# EAGLE design shield (EAGLE 9.2.2)
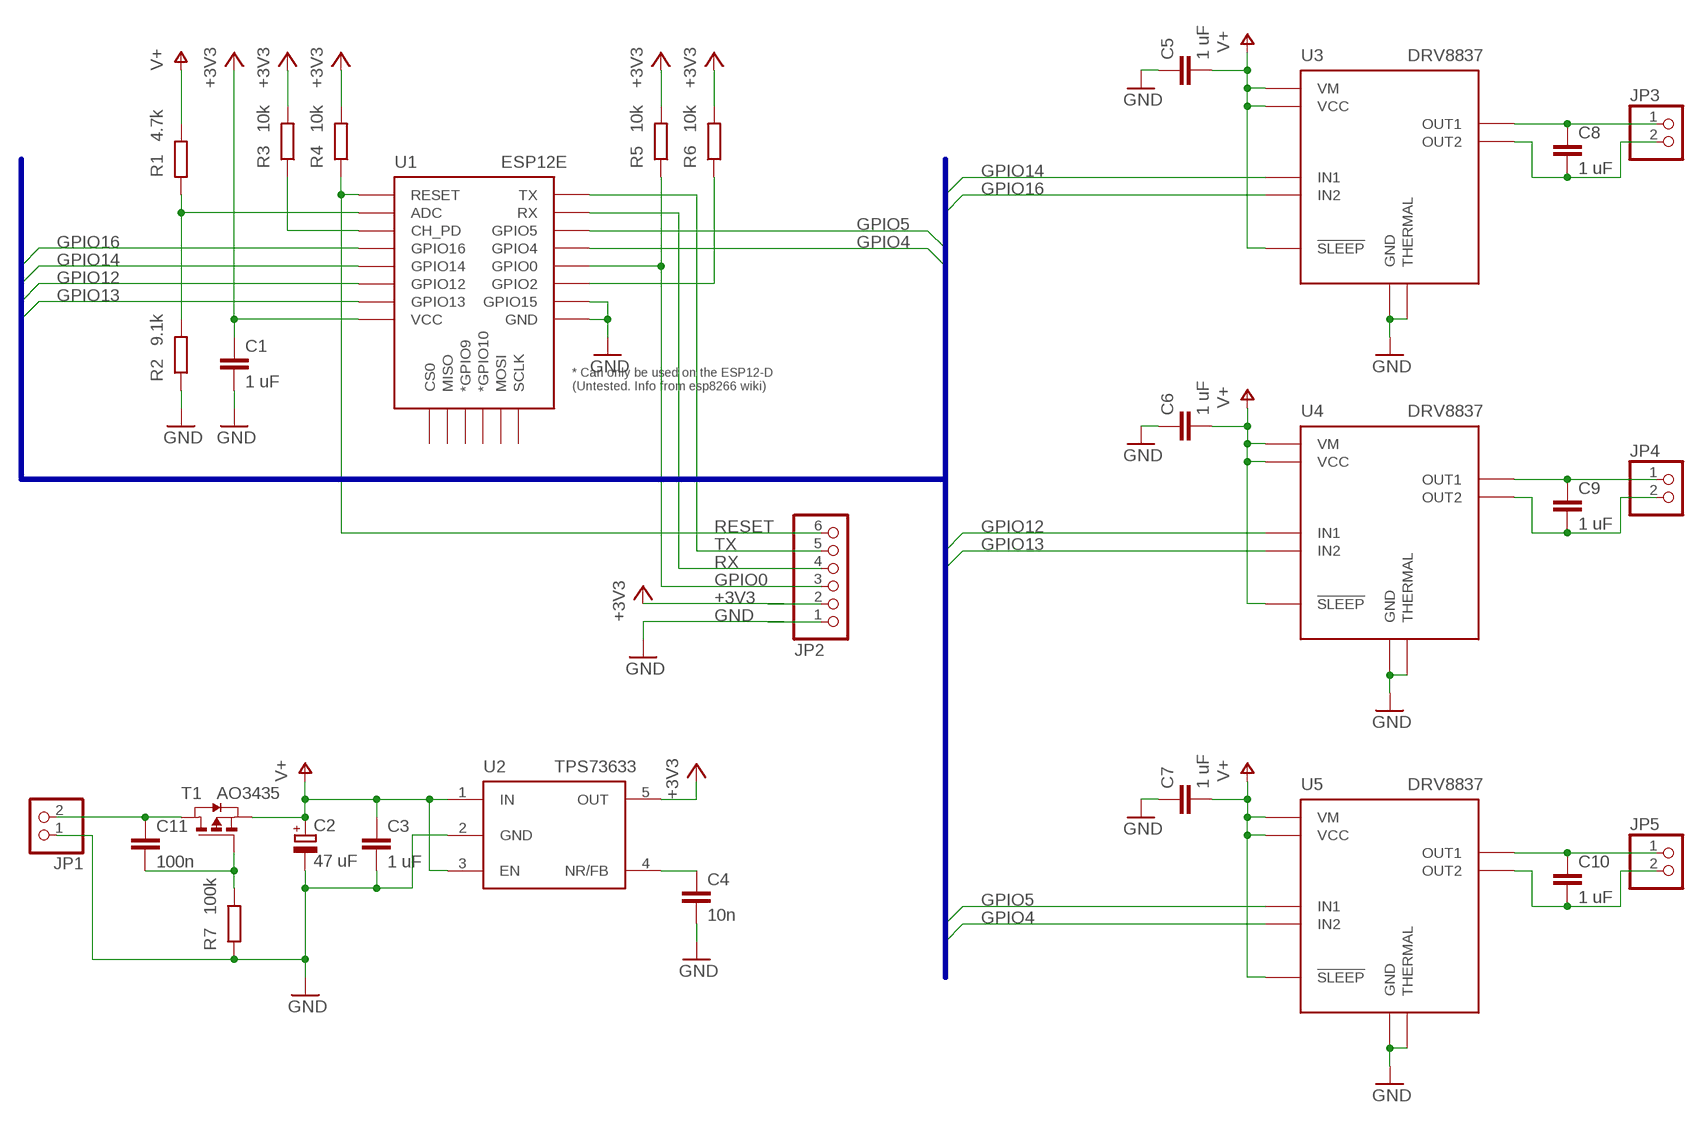
[diagram p0: schematic, sheet 1]

## Parts
C1  1 uF  C-EUC0805  [C0805]
C2  47 uF  CPOL-EUSMCA  [SMC_A]
C3  1 uF  C-EUC0805  [C0805]
C4  10n  C-EUC0603  [C0603]
C5  1 uF  C-EUC0805  [C0805]
C6  1 uF  C-EUC0805  [C0805]
C7  1 uF  C-EUC0805  [C0805]
C8  1 uF  C-EUC0805  [C0805]
C9  1 uF  C-EUC0805  [C0805]
C10  1 uF  C-EUC0805  [C0805]
C11  100n  C-EUC0603  [C0603]
JP1  PINHD-1X2  [1X02]
JP2  PINHD-1X6  [1X06]
JP3  PINHD-1X2  [1X02]
JP4  PINHD-1X2  [1X02]
JP5  PINHD-1X2  [1X02]
R1  4.7k  R-EU_R0603  [R0603]
R2  9.1k  R-EU_R0603  [R0603]
R3  10k  R-EU_R0603  [R0603]
R4  10k  R-EU_R0603  [R0603]
R5  10k  R-EU_R0603  [R0603]
R6  10k  R-EU_R0603  [R0603]
R7  100k  R-EU_R0603  [R0603]
T1  AO3435  PMOSSOT23  [SOT-23]
U1  ESP12E  ESP12ESMD  [ESP12E-SMD]
U2  TPS73633  [SOT23-5L]
U3  DRV8837  [QFN8]
U4  DRV8837  [QFN8]
U5  DRV8837  [QFN8]

## Nets
+3V3: C1.1 JP2.2 R3.2 R4.2 R5.2 R6.2 U1.VCC U2.5(OUT)
GND: C1.2 C2.- C3.2 C4.2 C5.1 C6.1 C7.1 JP1.1 JP2.1 R2.1 R7.1 U1.GND U1.GPIO15 U2.2(GND) U3.P$4(GND) U3.P$9(THERMAL) U4.P$4(GND) U4.P$9(THERMAL) U5.P$4(GND) U5.P$9(THERMAL)
GPIO0: JP2.3 R5.1 U1.GPIO0
GPIO4: U1.GPIO4 U5.P$5(IN2)
GPIO5: U1.GPIO5 U5.P$6(IN1)
GPIO12: U1.GPIO12 U4.P$6(IN1)
GPIO13: U1.GPIO13 U4.P$5(IN2)
GPIO14: U1.GPIO14 U3.P$6(IN1)
GPIO16: U1.GPIO16 U3.P$5(IN2)
N$1: R3.1 U1.CH_PD
N$2: R6.1 U1.GPIO2
N$3: C8.1 JP3.1 U3.P$2(OUT1)
N$4: C8.2 JP3.2 U3.P$3(OUT2)
N$5: C9.1 JP4.1 U4.P$2(OUT1)
N$6: C9.2 JP4.2 U4.P$3(OUT2)
N$7: C10.1 JP5.1 U5.P$2(OUT1)
N$8: C10.2 JP5.2 U5.P$3(OUT2)
N$9: R1.1 R2.2 U1.ADC
N$10: C4.1 U2.4(NR/FB)
N$14: C11.1 JP1.2 T1.1(D)
N$15: C11.2 R7.2 T1.3(G)
RESET: JP2.6 R4.1 U1.RESET
RX: JP2.4 U1.RXD0(RX)
TX: JP2.5 U1.TXD0(TX)
V+: C2.+ C3.1 C5.2 C6.2 C7.2 R1.2 T1.2(S) U2.1(IN) U2.3(EN) U3.P$1(VM) U3.P$7(!SLEEP) U3.P$8(VCC) U4.P$1(VM) U4.P$7(!SLEEP) U4.P$8(VCC) U5.P$1(VM) U5.P$7(!SLEEP) U5.P$8(VCC)
Unconnected: U1.CS0 U1.GPIO9(*GPIO9) U1.GPIO10(*GPIO10) U1.MISO U1.MOSI U1.SCLK

## Buses
GND,GPIO0,GPIO4,GPIO5,GPIO12,GPIO13,GPIO14,GPIO16,N$1,N$2,N$3,N$4,N$5,N$6,N$7,N$8,RESET,RX,TX,VCC

## Library data of the parts
C1 C3-C11 = rcl:C-EU: CAPACITOR, European symbol; SPICEPREFIX: C
C2 = rcl:CPOL-EU: POLARIZED CAPACITOR, European symbol; SPICEPREFIX: C
JP1 JP3-JP5 = pinhead:PINHD-1X2: PIN HEADER
JP2 = pinhead:PINHD-1X6: PIN HEADER
R1-R7 = rcl:R-EU_: RESISTOR, European symbol; SPICEPREFIX: R
T1 = zetex:PMOSSOT23: MOS FET; OC_FARNELL: unknown; OC_NEWARK: unknown
U1 = esp8266modules:ESP12E: ESP12E Module
U2 = Eagle-Library:TPS73633
U3-U5 = bt_motordriver:DRV8837: DRV8837 Low Voltage H-Bridge The DRV8837 provides an integrated motor-driver solution for cameras, consumer products, toys, and other low-voltage or battery-powered motion-control applications. The device has one H-bridge driver, and can drive one dc motor or one winding of a stepper motor, as well as other devices like solenoids. Reference: http://www.ti.com/lit/ds/symlink/drv8837.pdf

## Board
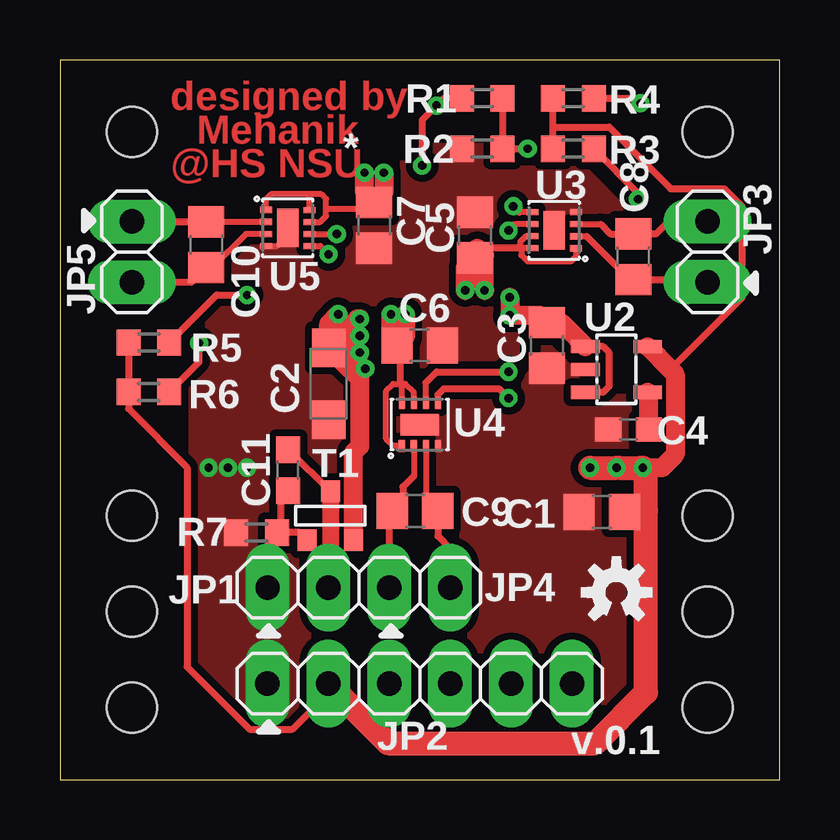
[diagram p1: board, top side]
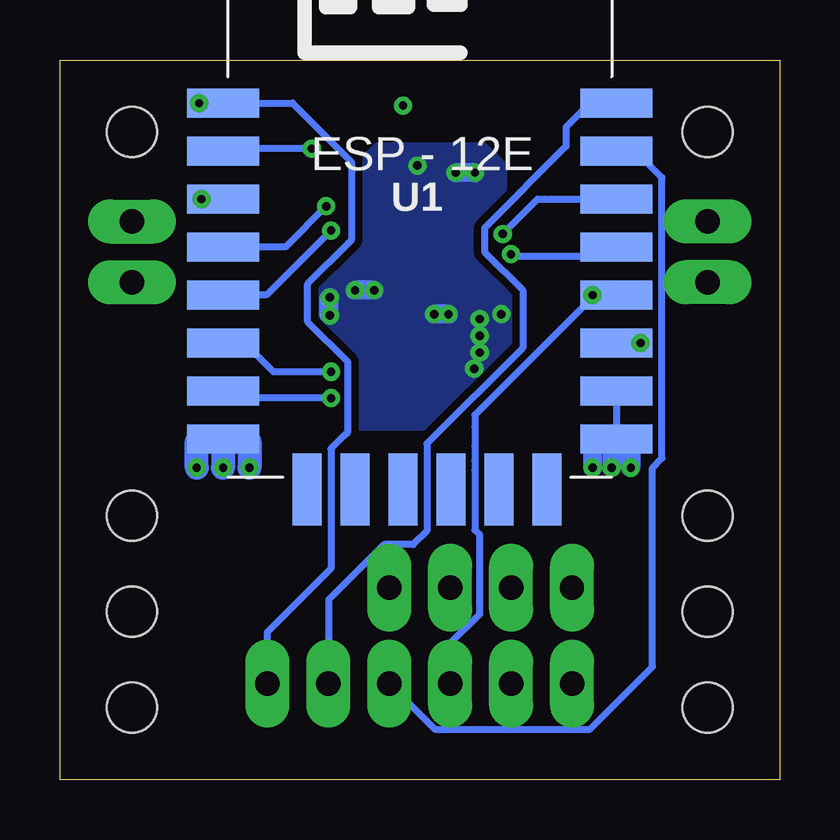
[diagram p2: board, bottom side, seen from below]

Size 30 x 30 mm. Coordinates in mm from the lower left corner, seen from the top.
Outline: 0,0 30,0 30,30 0,30 0,0
Copper layers (1*16): Top 0.035mm / dielectric 0.6mm / Bottom 0.035mm
Design rules "default *": minimum track width 6mil, minimum drill 0.35mm, track to track 6mil, track to pad 6mil, pad to pad 6mil, via to via 6mil, smd to smd 6mil, copper to edge 40mil, drill to drill 6mil, minimum pad ring 10mil, minimum via ring 8mil, stop-mask expansion 0.07mm, vias tented up to drill 1000mil, thermal gap 10mil
Holes 2.1 mm at 27,3 27,7 27,11 27,27 3,3 3,7 3,11 3,27

### Footprints (pad centres in the part's own frame; a part is rotated, then mirrored left to right if it is on the bottom)
C0805 = smd 1.3 x 1.5: 1 -0.95,0; 2 0.95,0
SMC_A = smd 1.6 x 1.4: + -1.5,0; - 1.5,0
C0603 = smd 1.1 x 1: 1 -0.85,0; 2 0.85,0
1X02 = drill 1.016 long: 1 -1.27,0; 2 1.27,0
1X06 = drill 1.016 long: 1 -6.35,0; 2 -3.81,0; 3 -1.27,0; 4 1.27,0; 5 3.81,0; 6 6.35,0
R0603 = smd 1 x 1.1: 1 -0.85,0; 2 0.85,0
SOT-23 = smd 0.787 x 0.889: 1 0.025,-1.016; 2 -0.94,1.016; 3 0.991,1.016
ESP12E-SMD = smd 3 x 1.2: ADC -8.3,3.8; CH_PD -8.3,1.8; GND 8.1,-8.2; GPIO0 8.1,-2.2; GPIO2 8.1,-4.2; GPIO4 8.1,-0.2; GPIO5 8.1,1.8; GPIO12 -8.3,-4.2; GPIO13 -8.3,-6.2; GPIO14 -8.3,-2.2; GPIO15 8.1,-6.2; GPIO16 -8.3,-0.2; RESET -8.3,5.8; RXD0 8.1,3.8; TXD0 8.1,5.8; VCC -8.3,-8.2 | smd 1.2 x 3: CS0 -4.8,-10.3; GPIO9 -0.8,-10.3; GPIO10 1.2,-10.3; MISO -2.8,-10.3; MOSI 3.2,-10.3; SCLK 5.2,-10.3
SOT23-5L = smd 0.55 x 1.2: 1 -0.95,-1.3; 2 0,-1.3; 3 0.95,-1.3; 4 0.95,1.3; 5 -0.95,1.3
QFN8 = smd 0.28 x 0.5: P$1 -0.75,-0.9; P$2 -0.25,-0.9 | smd 0.25 x 0.5: P$3 0.25,-0.9; P$4 0.75,-0.9; P$5 0.75,0.9; P$6 0.25,0.9; P$7 -0.25,0.9; P$8 -0.75,0.9 | smd 1.6 x 0.9: P$9 0,0

### Placement (x,y rotation side)
C1  22.59,11.16 180 top
C2  11.2,16.5 270 top
C3  20.3,18.1 270 top
C4  23.7,14.6 180 top
C5  17.3,22.7 270 top
C6  15,18.1 180 top
C7  13.1,23.1 90 top
C8  23.9,21.8 90 top
C9  14.8,11.2 0 top
C10  6.1,22.3 270 top
C11  9.5,12.9 270 top
JP1  9.93,8 0 top
JP2  15,4 0 top
JP3  27,22 90 top
JP4  15,8 0 top
JP5  3,22 270 top
R1  17.6,28.4 180 top
R2  17.6,26.3 0 top
R3  21.4,26.3 180 top
R4  21.4,28.4 180 top
R5  3.71,18.22 180 top
R6  3.71,16.16 180 top
R7  8.2,10.3 0 top
T1  11.3,11 180 top
U1  14.9,22.4 0 bottom
U2  23.2,17.1 270 top
U3  20.6,22.9 90 top
U4  15,14.8 0 top
U5  9.5,23 270 top

### Tracks (layer width: path | path; a pad name or v marks a point on that pad's centre or on a via)
+3V3  (via drill 0.35)
  Top 0.3: R5.2 R6.2 2.86,15.46 5.3,13.02 5.3,4.7 7.9,2.1 9.69,2.1 11.19,3.6 JP2.2 | R3.2 20.55,27 20.55,27.2 | 20.55,27.2 R4.2 | 20.55,27.2 22.9,27.2 25.47,24.63 27.7,24.63 28.43,23.9 28.43,20.08 25.45,17.1
  Top 0.8: v23.2,13 23.3,13 24.2,13 25.1,13 25.65,13.55 25.65,16.9 25.45,17.1 U2.5
  Top 1: v22.1,13 v23.2,13 | 23.3,13 24.2,13 | 24.2,13 v24.3,13 | JP2.2 13.67,1.52 22.32,1.52 24.43,3.63 24.43,11.2 | 24.2,13 24.43,12.77 24.43,11.2 | C1.1 24.39,11.16 24.43,11.2
  Bottom 1: v24.3,13 24.3,14.1 24.2,14.2 | v23.2,13 U1.VCC 22.2,14.2 22.1,14.1 v22.1,13
GND  (via drill 0.35)
  Top 0.254: U5.P$4 9.05,22.25 9.5,22.7 U5.P$9
  Top 1: C6.1 16.02,18.03
  Bottom 0.3: U1.GPIO15 U1.GND
  Bottom 0.8: 6.2,14.2 v6.2,13 | U1.GND 7.5,14.2 | U1.GND 7,14.4 | U1.GND 7,14 v7,13 | v7.8,13 7.8,14.2 U1.GND
  Bottom 1: 6.2,14.2 U1.GND
  pour Top (isolate 0.3, no thermals): 5.5,12.8 5.5,22.2 9.7,26.4 20.9,26.4 24.6,22.7 24.6,9.2 24.5,9.1 24.5,4.4 21.8,1.7 8.3,1.7 4.9,5.1 4.9,12.2
GPIO0  (via drill 0.35)
  Top 0.3: R5.1 6.54,20.2 v7.8,20.2
  Bottom 0.254: 12.7,14.7 12.7,12.9
  Bottom 0.3: U1.GPIO0 6.7,20.1 | v7.8,20.2 U1.GPIO0 | JP2.3 13.73,5.67 12.5,6.9 12.5,10.2 12.7,10.4 12.7,12.9 12.7,13.3 | 12.7,13.9 12.7,13.3 | U1.GPIO0 7.7,20.2 12.7,15.2 12.7,14.7 12.7,13.3
GPIO4  (via drill 0.35)
  Top 0.254: U5.P$5 10.85,22.25 v11.2,21.9
  Bottom 0.3: 7.1,21.9 U1.GPIO4 7.2,21.8 11.1,21.8 v11.2,21.9
GPIO5  (via drill 0.35)
  Top 0.254: U5.P$6 v11.54,22.75
  Top 0.3: v11.54,22.75 v11.54,22.74
  Bottom 0.3: U1.GPIO5 9.5,24.2 10.09,24.2 v11.54,22.74
GPIO12  (via drill 0.35)
  Top 0.254: U4.P$6 15.25,16.55
  Top 0.3: 15.25,16.55 15.7,17 v18.7,17
  Bottom 0.3: 21.4,17.3 21.95,17.85 | 21.95,17.85 22.3,18.2 U1.GPIO12 | 21.95,17.85 21.1,17 v18.7,17
GPIO13  (via drill 0.35)
  Top 0.254: U4.P$5 15.75,16.05
  Top 0.3: 15.75,16.05 16,16.3 18.3,16.3 v18.7,15.9
  Bottom 0.3: 22.9,16.5 23.15,16.25 | 23.15,16.25 U1.GPIO13 22.9,15.9 v18.7,15.9 | 23.1,16.3 23.15,16.25
GPIO14  (via drill 0.35)
  Top 0.254: U3.P$6 19.01,23.15 18.98,23.12
  Top 0.3: 18.98,23.12 18.93,23.12 v18.7,22.89
  Bottom 0.3: 22.4,20.2 U1.GPIO14 21.39,20.2 v18.7,22.89
GPIO16  (via drill 0.35)
  Top 0.254: U3.P$5 19.15,23.65
  Top 0.3: 19.15,23.65 v18.9,23.9
  Bottom 0.3: U1.GPIO16 20.6,22.2 v18.9,23.9
N$1  (via drill 0.35)
  Top 0.3: R3.1 24.1,24.45 v24.1,24.2
  Bottom 0.3: 24.2,24.2 v24.1,24.2 U1.CH_PD
N$2  (via drill 0.35)
  Top 0.3: R6.1 5.8,17.4 v5.8,18.2
  Bottom 0.3: U1.GPIO2 v5.8,18.2
N$3
  Top 0.254: U3.P$2 21.95,22.65
  Top 0.3: JP3.1 26.88,20.85 C8.1 23.75,20.85 21.95,22.65
N$4
  Top 0.254: U3.P$3 22.55,23.15
  Top 0.3: JP3.2 25.37,23.27 24.85,22.75 C8.2 22.95,22.75 22.55,23.15
N$5
  Top 0.254: U4.P$2 14.75,12.65
  Top 0.3: 13.97,11.32 C9.1 | JP4.1 13.73,11.08 13.97,11.32 | 13.97,11.32 14.3,11.65 14.3,12.2 14.75,12.65
N$6
  Top 0.254: U4.P$3 15.25,11.7
  Top 0.3: 15.25,11.7 C9.2 15.75,10.15 16.3,9.6 16.3,8.03 JP4.2
N$7
  Top 0.254: U5.P$2 C10.1
  Top 0.3: JP5.1 6.08,23.27 C10.1
N$8
  Top 0.254: 6.35,21.35 7.75,22.75 U5.P$3
  Top 0.3: 6.35,21.35 C10.2 5.48,20.73 JP5.2
N$9  (via drill 0.35)
  Top 0.3: v19.5,26.3 R2.2 R1.1
  Bottom 0.3: v19.5,26.3 23.1,26.3 U1.ADC
N$10
  Top 0.8: C4.1 24.55,16.1 U2.4
N$11
  cutout Top: 25.7,18.2 25.7,17 24.9,16.2 22.6,16.2 17.5,21.3 17.5,21.9 18.3,22.7 21.2,22.7
N$12
  cutout Top: 15.2,26.1 14.3,26.1 13.5,25.3 11.9,23.7 11.9,23.6 7.2,23.6 6.5,24.3 6.5,24.4 9.8,27.7 13.6,27.7
N$13
  cutout Top: 19.3,17 19.3,18.8 19.9,18.2 19.9,17.6
N$14
  Top 0.3: C11.1 9.54,13.75 T1.1
  Top 0.7: JP1.2 11.07,8.12 11.28,8.32 T1.1
N$15
  Top 0.3: T1.3 9.99,10.3 9.2,10.3 | 9.2,10.3 R7.2 | C11.2 9.2,11.75 9.2,10.3
RESET  (via drill 0.35)
  Top 0.3: R4.1 24,28.4 v24.2,28.2
  Bottom 0.3: v24.2,28.2 U1.RESET 20.3,28.2 17.85,25.75 17.85,22.5 17.98,22.38 19.68,20.68 19.68,19.07 18,17.4 18,14.5 18.15,14.35 18.7,13.8 18.7,8.8 21.35,6.15 JP2.6
RX
  Bottom 0.3: U1.RXD0 6,26.2 4.9,25.1 4.9,13.4 5.3,13 5.3,4.7 7.9,2.1 14.37,2.1 JP2.4
TX
  Bottom 0.3: U1.TXD0 7.9,28.2 8.9,27.2 8.9,26.4 12.3,23 12.3,22 10.7,20.4 10.7,18 14.65,14.05 | 14.65,14.05 14.7,14 | 14.65,14.05 14.7,14 | 14.7,14 14.7,10.37 15.27,9.8 16.5,9.8 18.8,7.5 JP2.5
V+  (via drill 0.35)
  Top 0.254: U3.P$7 19.42,22.65 19.19,22.41 19.19,22.2 | U3.P$8 19.24,22.15 19.24,21.86 19.5,21.6 21.3,21.6 21.5,21.8 U3.P$1 | U4.P$7 14.75,16.15 14.4,16.5 14.2,16.5 13.9,16.5 13.6,16.2 13.6,14.2 13.9,13.9 U4.P$1 | U4.P$8 14.25,16.45 | U5.P$7 10.85,23.25 11.1,23.5 11.1,23.8 | 11.1,23.8 12.85,23.8 | 11.1,23.8 11.1,24.2 10.9,24.4 10.4,24.4 | 10.4,24.4 8.8,24.4 8.6,24.2 U5.P$1 | U5.P$8 10.4,24.4
  Top 0.3: 17.7,22.15 19.24,22.15 19.19,22.2 | 17.7,22.15 C5.2 | 14.25,16.45 14.2,16.5 14.2,17.95 C6.2 | 12.85,23.8 C7.2 | U2.3 22.65,16.15 22.9,16.4 22.9,17.8 22.65,18.05 U2.1 | R1.2 16,28.4 v15.7,28.1 15.1,27.5 v15.1,25.6 | 17.7,22.15 17.4,22.15
  Top 0.8: v13.8,19.4 13.8,18.35 C6.2 14.4,18.45 v14.4,19.4 | v12.7,25.3 12.7,24.45 C7.2 13.5,24.45 v13.5,25.3 | U2.1 20.9,19.05 C3.1 20,19.35 v18.74,19.35 v18.75,19.35 v18.75,20.1 | v16.9,20.4 16.9,21.35 C5.2 | v17.7,20.4 17.7,21.85 17.4,22.15 | C2.+ 12.07,17.13 | 12.07,17.13 12.7,17.13 | C2.+ 11.4,17.8 v12.5,17.8 | C2.+ 11.7,18.5 v12.5,18.5 | C2.+ 12.4,19.2 v12.5,19.2 | C2.+ 11.2,19 v11.6,19.4 | T1.2 12.24,13.64 12.5,13.9 12.5,16.7 12.07,17.13
  Bottom 0.8: v13.8,19.4 v14.4,19.4 | v12.7,25.3 v13.5,25.3 | v18.74,19.35 18.79,19.4 18.79,20.06 v18.75,20.1 | v16.9,20.4 v17.7,20.4
  other vias: 12.73,17.13
  pour Bottom (isolate 0.3, no thermals): 11.5,23.7 11.5,25.6 12.3,26.4 16.8,26.4 17.9,25.3 17.9,23.1 20.3,20.7 20.3,14.9 20.5,14.7 11.3,14.7 9.8,16.2 9.8,22

### Text on the board
Top: designed by | Mehanik | @HS NSU
tNames: * | v.0.1
tStop: designed by | Mehanik | @HS NSU